# EAGLE design Air Quality Board (EAGLE 7.1.0)
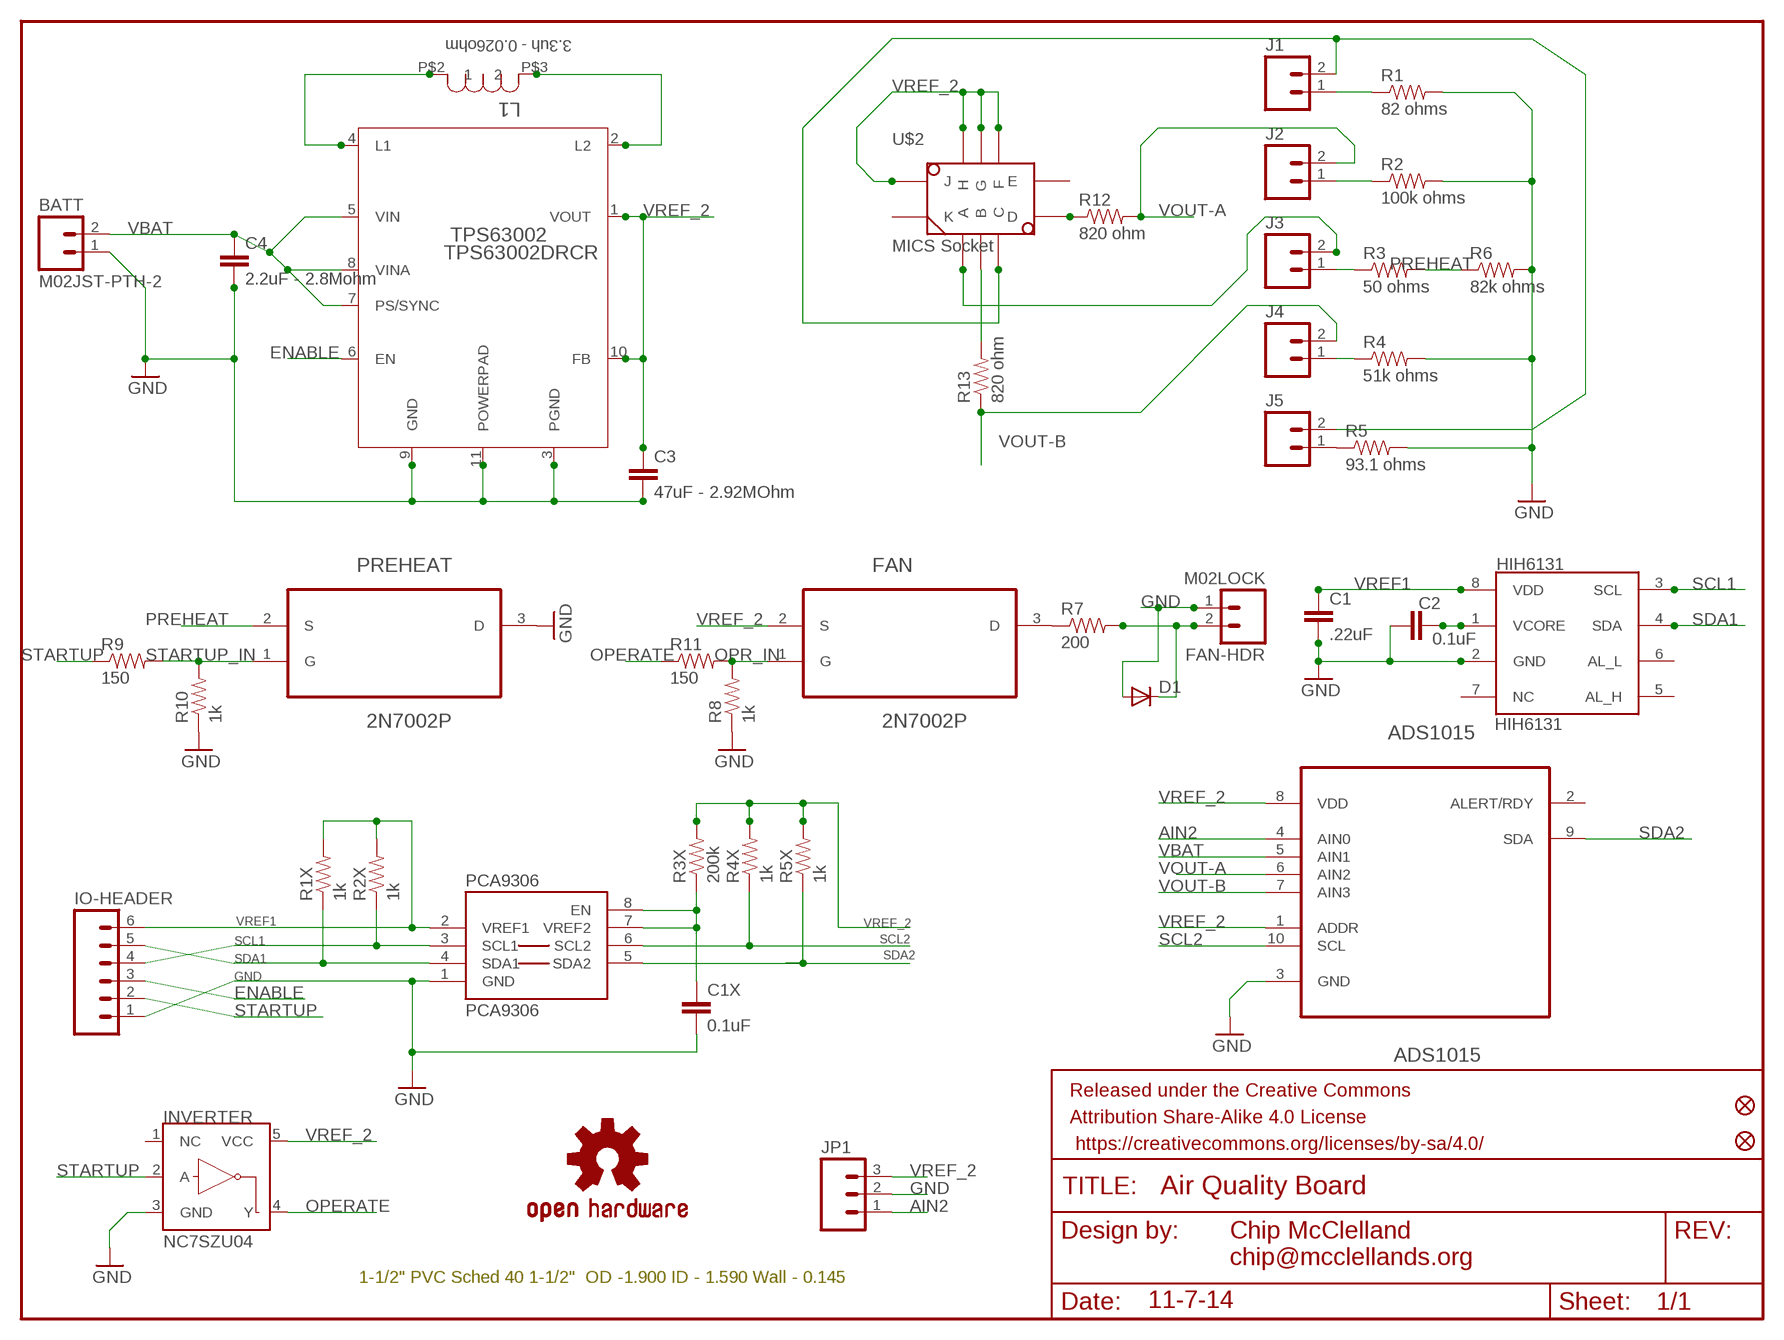
[diagram p0: schematic, sheet 1]

## Parts
ADS1015  ADS1015  ADS1015QDGSRQ1  [SOP50P490X110-10N]
BATT  M02JST-PTH-2  [JST-2-PTH]
C1  .22uF  CAP0805  [0805]
C1X  0.1uF  CAP0805  [0805]
C2  0.1uF  CAP0805  [0805]
C3  47uF - 2.92MOhm  CAP0805  [0805]
C4  2.2uF - 2.8Mohm  CAP1206  [1206]
D1  DIODESMA  [SMA-DIODE]
FAN  2N7002P  [SOT95P230X110-3N]
FAN-HDR  M02LOCK  [1X02_LOCK]
FRAME1  FRAME-LETTER  [CREATIVE_COMMONS]
HIH6131  HIH6131  [SOIC8]
IO-HEADER  M06LOCK  [1X06_LOCK]
J1  M02LOCK  [1X02_LOCK]
J2  M02LOCK  [1X02_LOCK]
J3  M02LOCK  [1X02_LOCK]
J4  M02LOCK  [1X02_LOCK]
J5  M02LOCK  [1X02_LOCK]
JP1  M03LOCK  [1X03_LOCK]
JP7  FIDUCIAL1X2.5  [FIDUCIAL-1X2.5]
JP8  FIDUCIAL1X2.5  [FIDUCIAL-1X2.5]
L1  3.3uh - 0.026ohm  SRR4028  [POWERINDUCTOR]
LOGO1  OSHW-LOGOS  [OSHW-LOGO-S]
NC7SZU04  INVERTER  [SOT23-5]
PCA9306  PCA9306  [SOIC8]
PREHEAT  2N7002P  [SOT95P230X110-3N]
R1  82 ohms  RESISTOR0805-RES  [0805]
R1X  1k  RESISTOR0805-RES  [0805]
R2  100k ohms  RESISTOR0805-RES  [0805]
R2X  1k  RESISTOR0805-RES  [0805]
R3  50 ohms  RESISTOR0805-RES  [0805]
R3X  200k  RESISTOR0805-RES  [0805]
R4  51k ohms  RESISTOR0805-RES  [0805]
R4X  1k  RESISTOR0805-RES  [0805]
R5  93.1 ohms  RESISTOR0805-RES  [0805]
R5X  1k  RESISTOR0805-RES  [0805]
R6  82k ohms  RESISTOR0805-RES  [0805]
R7  200  RESISTOR0805-RES  [0805]
R8  1k  RESISTOR0805-RES  [0805]
R9  150  RESISTOR0805-RES  [0805]
R10  1k  RESISTOR0805-RES  [0805]
R11  150  RESISTOR0805-RES  [0805]
R12  820 ohm  RESISTOR0805-RES  [0805]
R13  820 ohm  RESISTOR0805-RES  [0805]
TPS63002  TPS63002DRCR  [NEW-S-PVSON-N10]
U$2  MICS Socket  MICS-SMD-SOCKET  [MICS-SMD-SOCKET]

## Nets
AIN2: ADS1015.4(AIN0) JP1.1
ENABLE: IO-HEADER.3 TPS63002.6(EN)
FAN: FAN.3(D) R7.1
GND: ADS1015.3(GND) BATT.1 C1.2 C1X.2 C2.1 C3.2 C4.2 D1.A FAN-HDR.1 HIH6131.2(GND) IO-HEADER.1 JP1.2 NC7SZU04.3(GND) PCA9306.1(GND) PREHEAT.3(D) R1.2 R2.2 R4.2 R5.2 R6.2 R8.1 R10.1 TPS63002.3(PGND) TPS63002.9(GND) TPS63002.11(POWERPAD)
J1: J1.2 J5.2 U$2.C
J3: J3.2 U$2.A
N$1: J5.1 R5.1
N$2: J4.1 R4.1
N$3: J3.1 R3.1
N$4: J2.1 R2.1
N$5: J1.1 R1.1
N$6: R13.2 U$2.B
N$7: L1.P$2 TPS63002.4(L1)
N$8: L1.P$3 TPS63002.2(L2)
N$9: R12.1 U$2.D
N$11: D1.C FAN-HDR.2 R7.2
N$12: C2.2 HIH6131.1(VCORE)
OPERATE: NC7SZU04.4(Y) R11.1
OPR_IN: FAN.1(G) R8.2 R11.2
PREHEAT: PREHEAT.2(S) R3.2 R6.1
SCL1: HIH6131.3(SCL) IO-HEADER.4 PCA9306.3(SCL1) R2X.1
SCL2: ADS1015.10(SCL) PCA9306.6(SCL2) R4X.1
SDA1: HIH6131.4(SDA) IO-HEADER.5 PCA9306.4(SDA1) R1X.1
SDA2: ADS1015.9(SDA) PCA9306.5(SDA2) R5X.1
STARTUP: IO-HEADER.2 NC7SZU04.2(A) R9.1
STARTUP_IN: PREHEAT.1(G) R9.2 R10.2
VBAT: ADS1015.5(AIN1) BATT.2 C4.1 TPS63002.5(VIN) TPS63002.7(PS/SYNC) TPS63002.8(VINA)
VOUT-A: ADS1015.6(AIN2) J2.2 R12.2
VOUT-B: ADS1015.7(AIN3) J4.2 R13.1
VREF1: C1.1 HIH6131.8(VDD) IO-HEADER.6 PCA9306.2(VREF1) R1X.2 R2X.2
VREF2: C1X.1 PCA9306.7(VREF2) PCA9306.8(EN) R3X.1
VREF_2: ADS1015.1(ADDR) ADS1015.8(VDD) C3.1 FAN.2(S) JP1.3 NC7SZU04.5(VCC) R3X.2 R4X.2 R5X.2 TPS63002.1(VOUT) TPS63002.10(FB) U$2.F U$2.G U$2.H U$2.J
Unconnected: ADS1015.2(ALERT/RDY) HIH6131.5(AL_H) HIH6131.6(AL_L) HIH6131.7(NC) NC7SZU04.1(NC) U$2.E U$2.K

## Notes on the sheet
- Chip McClelland
  chip@mcclellands.org
- 1-1/2" PVC Sched 40 1-1/2"  OD -1.900 ID - 1.590 Wall - 0.145
- 11-7-14

## Library data of the parts
ADS1015 = Texas Instruments_By_element14_Batch_1:ADS1015QDGSRQ1: ADC; MPN: ADS1015QDGSRQ1; OC_FARNELL: -; OC_NEWARK: 99R9767; PACKAGE: MSOP-10; SUPPLIER: Texas Instruments
BATT = SparkFun-Connectors:M02: Standard 2-pin 0.1" header. Use with - straight break away headers ( PRT-00116) - right angle break away headers (PRT-00553) - swiss pins (PRT-00743) - machine pins (PRT-00117) - female headers (PRT-00115) Molex polarized connector foot print use with: PRT-08233 with associated crimp pins and housings. 2.54_SCREWTERM for use with PRT-10571. 3.5mm Screw Terminal footprints for PRT-08084 5mm Screw Terminal footprints for use with PRT-08433; SKU: PRT-09914
C1 C1X C2-C4 = SparkFun-Capacitors:CAP: Capacitor Standard 0603 ceramic capacitor, and 0.1" leaded capacitor.
D1 = SparkFun-DiscreteSemi:DIODE: Diode These are standard reverse protection diodes and small signal diodes. SMA package can handle up to about 1A. SOD-323 can handle about 200mA. What the SOD-323 package when ordering, there are some mfgs out there that are 5-pin packages.
FAN PREHEAT = NXP_By_element14_Batch_1:2N7002P: MOSFET; MPN: 2N7002P; OC_FARNELL: 1859848; OC_NEWARK: 28T0307; PACKAGE: SOT-23-3; SUPPLIER: NXP
FAN-HDR J1-J5 = SparkFun-Connectors:M02: Standard 2-pin 0.1" header. Use with - straight break away headers ( PRT-00116) - right angle break away headers (PRT-00553) - swiss pins (PRT-00743) - machine pins (PRT-00117) - female headers (PRT-00115) Molex polarized connector foot print use with: PRT-08233 with associated crimp pins and housings. 2.54_SCREWTERM for use with PRT-10571. 3.5mm Screw Terminal footprints for PRT-08084 5mm Screw Terminal footprints for use with PRT-08433
FRAME1 = SparkFun-Aesthetics:FRAME-LETTER: Schematic Frame Standard 8.5x11 US Letter frame
HIH6131 = HIH6130_Breakout_v10:HIH6131
IO-HEADER = SparkFun-Connectors:M06: Header 6 Standard 6-pin 0.1" header. Use with straight break away headers (SKU : PRT-00116), right angle break away headers (PRT-00553), swiss pins (PRT-00743), machine pins (PRT-00117), and female headers (PRT-00115). Molex polarized connector foot print use with SKU : PRT-08094 with associated crimp pins and housings. NOTES ON THE VARIANTS LOCK and LOCK_LONGPADS... This footprint was designed to help hold the alignment of a through-hole component (i.e. 6-pin header) while soldering it into place. You may notice that each hole has been shifted either up or down by 0.005 of an inch from it's more standard position (which is a perfectly straight line). This slight alteration caused the pins (the squares in the middle) to touch the edges of the holes. Because they are alternating, it causes a "brace" to hold the component in place. 0.005 has proven to be the perfect amount of "off-center" position when using our standard breakaway headers. Although looks a little odd when you look at the bare footprint, once you have a header in there, the alteration is very hard to notice. Also,if you push a header all the way into place, it is covered up entirely on the bottom side. This idea of altering the position of holes to aid alignment will be further integrated into the Sparkfun Library for other footprints. It can help hold any component with 3 or more connection pins.
JP1 = SparkFun-Connectors:M03: Header 3 Standard 3-pin 0.1" header. Use with straight break away headers (SKU : PRT-00116), right angle break away headers (PRT-00553), swiss pins (PRT-00743), machine pins (PRT-00117), and female headers (PRT-00115). Molex polarized connector foot print use with SKU : PRT-08232 with associated crimp pins and housings.
JP7 JP8 = abes:FIDUCIAL: Fiducial Alignment Points Various fiducial points for machine vision alignment.
L1 = Bourns_By_element14_Batch_1:SRR4028
LOGO1 = SparkFun-Aesthetics:OSHW-LOGO: Open Source Hardware Logo This logo indicates the piece of hardware it is found on incorporates a OSHW license and/or adheres to the definition of open source hardware found here: http://freedomdefined.org/OSHW
NC7SZU04 = SparkFun-DigitalIC:INVERTER: Single inverter, SOT23-5
PCA9306 = SparkFun-DigitalIC:PCA9306: Bidirectional I2C level shifter. NOT compatible with all available part number pinout schemes- DOUBLE CHECK!!!
R1 R1X R2 R2X R3 R3X R4 R4X R5 R5X R6-R13 = SparkFun-Passives:RESISTOR: Resistor Basic schematic elements and footprints for 0603, 1206, and PTH resistors.
TPS63002 = TI TPS63002:TPS63002DRCR
U$2 = Custom Components:MICS-SMD-SOCKET

## Board
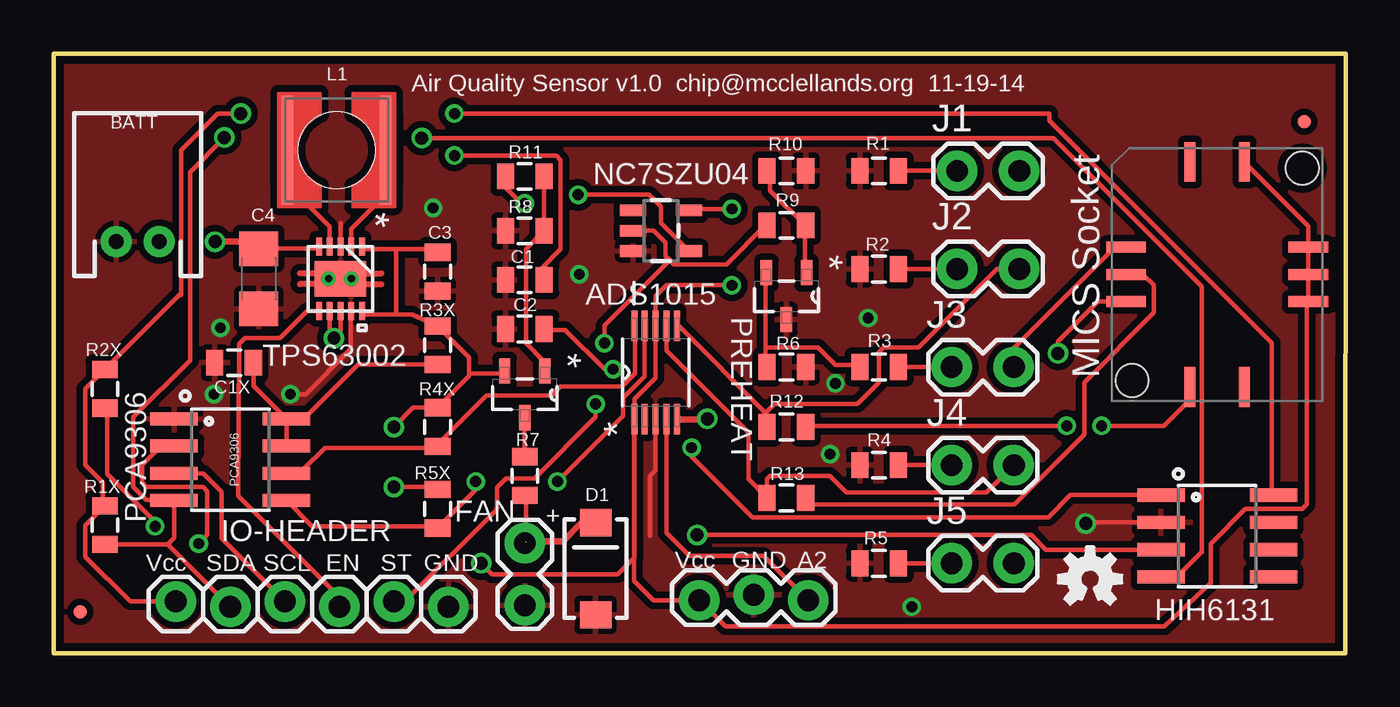
[diagram p1: board, top side]
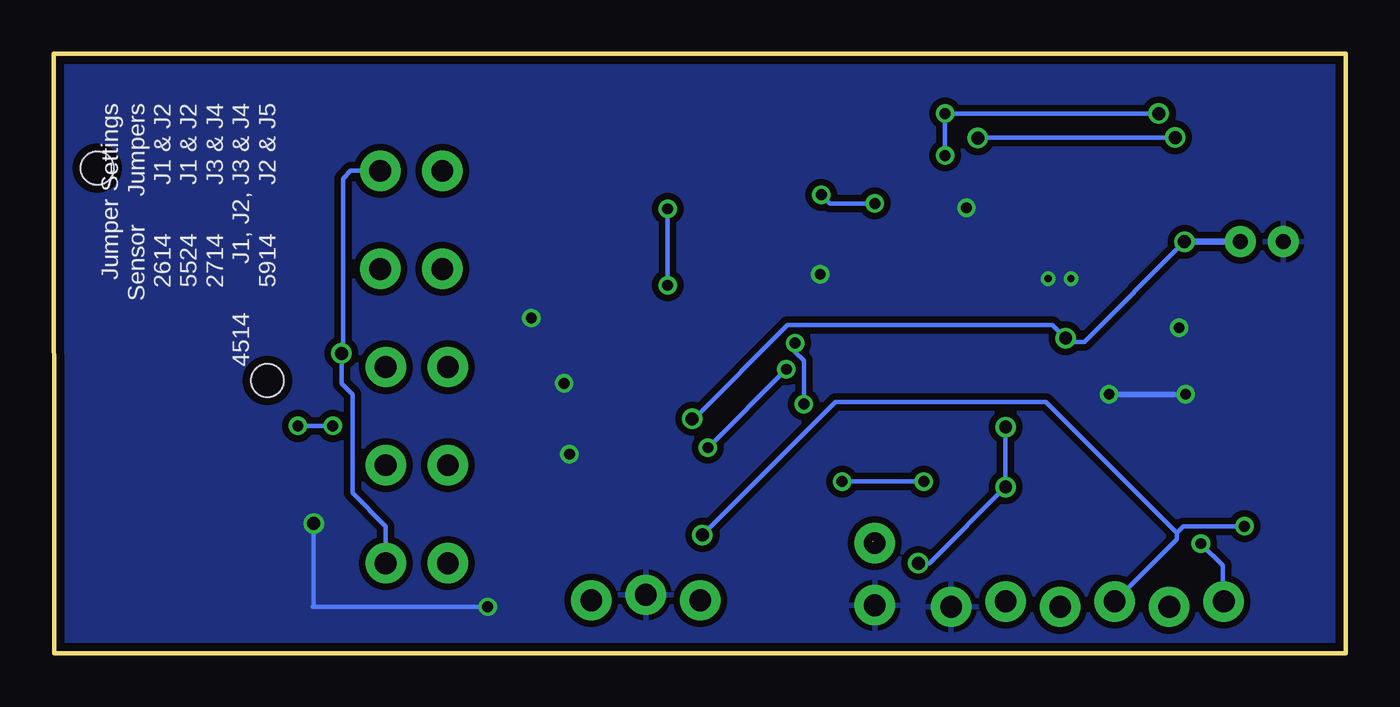
[diagram p2: board, bottom side, seen from below]

Size 60.2 x 27.94 mm. Coordinates in mm from the lower left corner, seen from the top.
Outline: 0,0 60.18,0 60.2,27.94 0,27.94 0,0
Copper layers (1*16): Top 0.0356mm / dielectric 1.5011mm / Bottom 0.0356mm
Design rules "LaenPCBOrder": minimum track width 6mil, minimum drill 13mil, track to track 6mil, track to pad 6mil, pad to pad 6mil, via to via 6mil, smd to smd 6mil, copper to edge 15mil, drill to drill 6mil, minimum pad ring 7mil, minimum via ring 7mil, stop-mask expansion 3mil, vias tented up to drill 0mil, thermal gap 10mil
tRestrict: area 7.3,3.8 to 7.6,4.1

### Footprints (pad centres in the part's own frame; a part is rotated, then mirrored left to right if it is on the bottom)
SOP50P490X110-10N = smd 1.422 x 0.279: 1 -2.184,0.991; 2 -2.184,0.508; 3 -2.184,0; 4 -2.184,-0.508; 5 -2.184,-0.991; 6 2.184,-0.991; 7 2.184,-0.508; 8 2.184,0; 9 2.184,0.508; 10 2.184,0.991
JST-2-PTH = drill 0.7 pad 1.448: 1 -1,0; 2 1,0
0805 = smd 0.8 x 1.2: 1 -0.9,0; 2 0.9,0
1206 = smd 1.6 x 1.8: 1 -1.4,0; 2 1.4,0
SMA-DIODE = smd 1.27 x 1.47: A -2.15,0; C 2.15,0
SOT95P230X110-3N = smd 1.168 x 0.533: 1 -1.092,0.94; 2 -1.092,-0.94; 3 1.092,0
1X02_LOCK = drill 1.016 pad 1.88: 1 -0.178,0; 2 2.718,0
SOIC8 = smd 0.61 x 2.21: 1 -1.905,-2.616; 2 -0.635,-2.616; 3 0.635,-2.616; 4 1.905,-2.616; 5 1.905,2.616; 6 0.635,2.616; 7 -0.635,2.616; 8 -1.905,2.616
1X06_LOCK = drill 1.016 pad 1.88: 1 0,0; 2 2.54,-0.254; 3 5.08,0; 4 7.62,-0.254; 5 10.16,0; 6 12.7,-0.254
1X03_LOCK = drill 1.016 pad 1.88: 1 0,0.127; 2 2.54,-0.127; 3 5.08,0.127
FIDUCIAL-1X2.5 = smd 0.635 x 0.635: 1 0,0
POWERINDUCTOR = smd 5.08 x 0.508: P$2 0,2.286; P$3 0,-2.286
SOT23-5 = smd 0.55 x 1.2: 1 -0.95,-1.3; 2 0,-1.3; 3 0.95,-1.3; 4 0.95,1.3; 5 -0.95,1.3
NEW-S-PVSON-N10 = smd 0.85 x 0.28: 1 -1.5,1; 2 -1.5,0.5; 3 -1.5,0; 4 -1.5,-0.5; 5 -1.5,-1; 6 1.5,-1; 7 1.5,-0.5; 8 1.5,0; 9 1.5,0.5; 10 1.5,1 | smd 1.65 x 2.4: 11 0,0
MICS-SMD-SOCKET = smd 0.508 x 1.854: A -1.27,-4.242; B 0,-4.242; C 1.27,-4.242; F 1.27,4.242; G 0,4.242; H -1.27,4.242 | smd 1.854 x 0.508: D 5.245,-1.27; E 5.245,1.27; J -5.245,1.27; K -5.245,-1.27 | hole 1.524: -4.953,3.962; 4.953,-3.962

### Placement (x,y rotation side)
ADS1015  28.04,13.08 90 top
BATT  3.91,19.18 0 top
C1  21.95,17.4 180 top
C1X  8.41,13.54 180 top
C2  21.95,15.11 0 top
C3  17.88,17.78 270 top
C4  9.55,17.45 270 top
D1  25.25,3.94 90 top
FAN  21.95,12.06 270 top
FAN-HDR  21.95,2.41 90 top
FRAME1  7.62,-10.16 0 top  (outside the outline)
HIH6131  54.2,5.46 270 top
IO-HEADER  18.39,2.16 180 top
J1  42.27,22.48 0 top
J2  42.27,17.91 0 top
J3  42.01,13.34 0 top
J4  42.01,8.76 0 top
J5  42.01,4.19 0 top
JP1  35.15,2.59 180 top
JP7  58.27,24.77 0 top
JP8  1.24,1.94 65.1 top
L1  13.18,23.44 90 top
LOGO1  48.29,3.45 0 top
NC7SZU04  28.3,19.68 270 top
PCA9306  8.23,9.02 270 top
PREHEAT  34.14,16.64 270 top
R1  38.46,22.48 180 top
R1X  2.39,5.97 90 top
R2  38.46,17.91 180 top
R2X  2.39,12.32 90 top
R3  38.46,13.34 180 top
R3X  17.88,14.35 90 top
R4  38.46,8.76 180 top
R4X  17.88,10.54 90 top
R5  38.46,4.19 180 top
R5X  17.88,6.73 90 top
R6  34.14,13.34 0 top
R7  21.95,8.26 270 top
R8  21.95,19.68 0 top
R9  34.14,19.94 0 top
R10  34.14,22.48 180 top
R11  21.95,22.23 0 top
R12  34.14,10.54 180 top
R13  34.14,7.24 0 top
TPS63002  13.36,17.45 270 top
U$2  54.2,17.65 270 top

### Tracks (layer width: path | path; a pad name or v marks a point on that pad's centre or on a via)
AIN2
  Top 0.203: ADS1015.4 28.55,5.61 29.62,4.55 33.07,4.55 JP1.1
ENABLE
  Top 0.203: TPS63002.6 11.81,15.95 10.54,14.68 8.91,14.68 8.64,14.4 8.64,14.33 8.59,7.34 13.26,2.67 13.26,2.21 IO-HEADER.3
FAN
  Top 0.203: FAN.3 R7.1
GND  (via drill 0.33, 0.5, 0.6)
  Top 0.203: 27.79,5.46 27.79,8.26 28.04,8.51 ADS1015.3 | HIH6131.2 48.13,6.1 v48.08,6.04 | v11.02,12.06 11.73,12.06 13.84,14.17 13.84,15.93 TPS63002.9 | TPS63002.3 13.36,20.04
  Bottom 0.203: v48.08,6.04 48.08,2.21 48.13,2.16 v39.98,2.16
  Bottom 0.254: v11.02,12.06 v7.47,12.06
  other vias: 17.68,20.75 7.77,15.16 24.49,17.65 37.95,15.62 36.17,9.27 36.42,12.57 12.8,17.45 13.87,17.45
  pour Bottom (isolate 0.305): -1.24,29.46 61.65,29.64 61.98,-1.02 -1.27,-1.27
  pour Top (isolate 0.305): -1.35,29.49 61.62,29.29 62.23,-1.02 -1.27,-1.27
J1  (via drill 0.6)
  Top 0.203: v46.79,13.97 46.79,14.53 48.64,16.38 U$2.C
  Bottom 0.203: J1.2 46.35,22.48 46.71,22.12 46.71,14.05 v46.79,13.97 46.79,12.57 46.28,12.06 46.28,7.47 44.73,5.92 J5.2
J3
  Top 0.203: U$2.A 49.43,18.92 44.76,14.25 44.76,13.36 J3.2
N$1
  Top 0.203: R5.1 J5.1
N$2
  Top 0.203: J4.1 R4.1
N$3
  Top 0.203: R3.1 J3.1
N$4
  Top 0.203: J2.1 R2.1
N$5
  Top 0.203: R1.1 J1.1
N$6
  Top 0.203: R13.2 35.34,6.93 44.76,6.93 48.01,10.19 48.01,12.62 51.26,15.88 51.26,17.14 50.75,17.65 U$2.B
N$7
  Top 0.203: L1.P$2 11.43,21.31 12.85,19.89 TPS63002.4
N$8
  Top 0.203: TPS63002.2 13.86,19.75 14.94,20.83 L1.P$3
N$9  (via drill 0.51)
  Top 0.203: v48.82,10.59 51.71,10.59 52.93,11.81 U$2.D | v47.19,10.59 35.09,10.59 R12.1
  Bottom 0.203: v48.82,10.59 v47.19,10.59
N$11  (1 unrouted)
  Top 0.203: 22,7.34 22,5.18 FAN-HDR.2
  Top 0.305: D1.C 24.6,6.09 23.72,5.21 22.02,5.21
  Top 0.406: 22,7.34 21.95,7.34 R7.2
N$12  (via drill 0.51)
  Top 0.203: v26.06,13.23 25.65,13.23 23.82,15.06 22.9,15.06 C2.2 | v29.72,9.58 29.72,9.17 32.56,6.33 46.33,6.33 47.37,7.37 HIH6131.1
  Bottom 0.203: v29.72,9.58 v26.06,13.23
OPERATE  (via drill 0.51)
  Top 0.203: v21.95,20.95 21.79,20.95 21.06,21.69 21.06,22.21 R11.1 | NC7SZU04.4 28.3,20.04 28.3,20.8 27.74,21.36 v24.43,21.36
  Bottom 0.203: v24.43,21.36 24.03,20.95 v21.95,20.95
OPR_IN
  Top 0.203: FAN.1 22.81,13.23 22.81,13.64 22,14.45 22,18.84 R8.2 R11.2
PREHEAT
  Top 0.203: 33.17,14.25 33.17,17.7 PREHEAT.2 | 33.17,14.25 35.61,14.25 36.42,13.44 37.45,13.44 R3.2 | 33.17,14.25 33.17,13.4 R6.1
SCL1  (via drill 0.51, 0.6)
  Top 0.203: v4.72,5.92 4.72,6.12 2.49,8.36 2.49,11.32 R2X.1 | HIH6131.3 46.23,4.83 45.54,5.51 v29.97,5.51 | PCA9306.3 6.96,8.38 7.82,7.52 7.82,5.36 IO-HEADER.4
  Bottom 0.203: v4.72,5.92 7.57,5.92 7.87,5.61 | 7.87,5.61 13.97,11.71 23.77,11.71 v29.97,5.51 | 7.87,5.61 7.87,5.31 IO-HEADER.4
SCL2
  Top 0.203: PCA9306.6 11.02,8.56 11.63,8.56 12.65,9.58 17.82,9.58 R4X.1 17.88,9.73 20.17,12.01 23.22,12.01 23.62,12.42 26.47,12.42 27.08,13.03 27.08,15.27 ADS1015.10
SDA1  (via drill 0.6)
  Top 0.203: HIH6131.4 52.32,3.56 53.47,4.7 53.49,4.7 53.49,17.09 46.58,24 v17.14,24 | 5.31,5.08 5.61,5.38 PCA9306.4 5.59,7.14 4.32,7.14 3.71,7.75 3.71,11 6.35,13.64 6.35,22.43 v7.95,24.03 | 5.31,5.08 R1X.1 | 5.31,5.08 IO-HEADER.5
  Bottom 0.203: v7.95,24.03 17.12,24.03 v17.14,24
SDA2  (via drill 0.5)
  Top 0.203: PCA9306.5 12.04,5.92 17.79,5.92 R5X.1 19.66,7.61 v19.66,8 | v23.47,8 26.52,11.05 26.52,11.89 27.53,12.9 ADS1015.9
  Bottom 0.203: v23.47,8 v19.66,8
STARTUP  (via drill 0.51)
  Top 0.203: 28.7,18.31 28.91,18.11 31.34,18.11 33.17,19.94 R9.1 | 28.7,18.31 28.5,18.52 28.5,19.13 27.94,19.68 NC7SZU04.2 | 28.7,18.31 25.65,15.27 v25.65,14.45 | v25.25,11.61 25.25,11 22.4,8.15 21.08,8.15 20.65,7.72 20.65,6.81 20.62,6.78 20.62,6.68 16.36,2.41 IO-HEADER.2
  Bottom 0.203: v25.65,14.45 25.65,14.05 25.25,13.64 v25.25,11.61
STARTUP_IN
  Top 0.203: 35,19.94 33.38,21.57 33.38,22.34 R10.2 | 35,19.94 R9.2 | 35,19.94 35,17.8 PREHEAT.1
VBAT  (via drill 0.6)
  Top 0.203: C4.1 12.26,18.85 TPS63002.5 | TPS63002.8 13.36,14.99 v13.06,14.68 12.86,14.88 TPS63002.7
  Top 0.305: v7.52,19.18 9.22,19.18 C4.1 | ADS1015.5 30.43,10.9 v30.45,10.92
  Bottom 0.203: v30.45,10.92 30.38,10.92 26.01,15.29 13.66,15.29 v13.06,14.68 | v13.06,14.68 12.88,14.5 12.8,14.5 | 12.8,14.5 12.19,14.5 v7.52,19.18 | v13.06,14.68 12.98,14.68 12.8,14.5
  Bottom 0.305: BATT.2 v7.52,19.18
VOUT-A
  Top 0.203: 33.17,11.2 29.11,15.27 ADS1015.6 | J2.2 43.94,17.91 40.28,14.25 38.66,14.25 38.46,14.05 38.46,12.62 37.44,11.61 33.58,11.61 33.17,11.2 | 33.17,11.2 33.17,10.61 R12.2
VOUT-B
  Top 0.203: ADS1015.7 28.55,14.1 32.36,10.29 32.36,8.12 R13.1 33.24,8.12 33.38,8.26 36.17,8.26 36.93,7.49 43.46,7.49 J4.2
VREF1  (via drill 0.51, 0.6)
  Top 0.203: v6.76,5.11 7.16,5.51 7.16,7.54 6.96,7.75 4.32,7.75 4.12,7.95 4.12,8.76 4.93,9.58 5.54,9.58 PCA9306.2 | v18.67,23.19 23.42,23.19 23.62,22.99 23.62,18.82 22.71,17.91 22.71,17.54 C1.1 | v18.67,25.15 46.38,25.15 46.38,24.82 56.74,14.45 56.74,7.44 HIH6131.8 | IO-HEADER.6 3.56,2.41 1.47,4.5 1.47,5.96 R1X.2 2.29,6.97 2.29,7.95 1.47,8.76 1.47,12.3 R2X.2 5.86,16.69 5.94,16.69 5.94,23.44 7.64,25.15 v8.71,25.15
  Bottom 0.203: IO-HEADER.6 5.74,2.46 5.74,4.09 v6.76,5.11 | v18.67,23.19 v18.67,25.15 v8.71,25.15
VREF2
  Top 0.203: 9.4,13.84 C1X.1 9.31,12.46 PCA9306.8 | R3X.1 14.19,13.45 11.79,11.05 10.97,11.05 PCA9306.8 | PCA9306.7 PCA9306.8
VREF_2  (via drill 0.5, 0.6)
  Top 0.203: 15.95,15.77 16.7,15.77 R3X.2 19.36,13.78 19.36,13.03 | 15.95,15.77 15.95,18.82 | 19.36,13.03 19.36,12.91 R4X.2 16.75,11.44 v15.85,10.54 | ADS1015.1 27.05,11.84 28.04,12.83 ADS1015.8 28.04,16.64 28.55,17.14 v31.6,17.14 | v31.6,20.7 29.66,20.7 NC7SZU04.5 | ADS1015.1 27.03,10.87 27.03,3.38 27.94,2.46 JP1.3 31.29,1.25 51.74,1.25 53.9,3.28 53.9,5.11 55.52,6.73 58.17,6.73 58.37,6.93 58.37,16.31 U$2.F U$2.G U$2.H 58.45,19.91 55.47,22.89 U$2.J | ADS1015.1 27.05,4.47 26.26,3.68 20.42,3.68 v19.91,4.19 | v15.85,7.75 17.77,7.75 R5X.2 | 15.95,18.82 14.49,18.82 TPS63002.1 | 15.95,18.82 17.71,18.82 C3.1 | 19.36,13.03 20.88,13.03 FAN.2 | 15.95,15.77 14.54,15.77 TPS63002.10
  Bottom 0.203: v31.6,17.14 v31.6,20.7 | v19.91,4.19 19.41,4.19 v15.85,7.75 v15.85,10.54

### Text on the board
tPlace: PCA9306
tNames: Air Quality Sensor v1.0 chip@mcclellands.org 11-19-14 | + | Vcc | SDA | SCL | EN | ST | GND | Vcc | GND | A2
bNames: Jumper Settings / Sensor Jumpers / 2614 J1 & J2 / 5524 J1 & J2 / 2714 J3 & J4 / 4514 J1, J2, J3 & J4 / 5914 J2 & J5
tDocu: Chip McClelland chip@mcclellands.org